# Altium schematic sheet Sheet1.SchDoc
size A; SheetNumber: 1; SheetTotal: 1
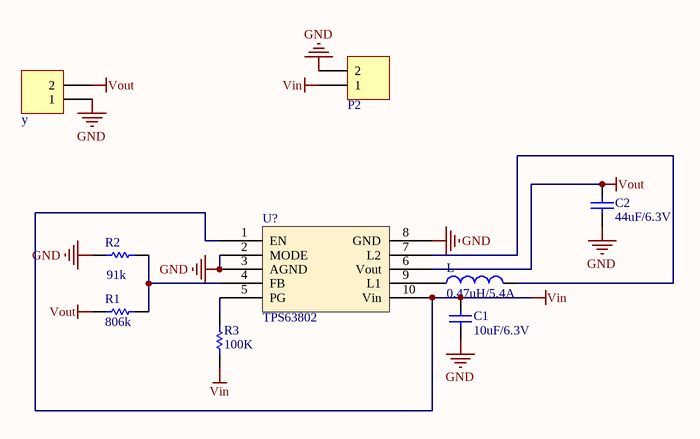
[diagram p0: Sheet1.SchDoc]

## Parts
C1  value 10uF/6.3V  [CAP-SM-0805]  (hidden comment: Cap Non-Pol SMD)
C2  value 44uF/6.3V  [CAP-SM-0805]  (hidden comment: Cap Non-Pol SMD)
L  value 0.47uH/5.4A  [INDUCTOR 12.5x12.5]  (hidden comment: Inductor)
P2  Domino 2  [DOMINO 2- 5mm]  (value not drawn)
R1  value 806k  [RES-SM-0603]  (hidden comment: RESISTOR SMD)
R2  value 91k  [RES-SM-0603]  (hidden comment: RESISTOR SMD)
R3  value 100K  [RES-SM-0603]  (hidden comment: RESISTOR SMD)
U?  TPS63802  [TPS63802]
y  Domino 2  [DOMINO 2- 5mm]  (value not drawn)

## Nets
GND: C1.2 C2.2 P2.2 R2.2 U?.2(MODE) U?.3(AGND) U?.8(GND) y.1
Vin: C1.1 P2.1 R3.1 U?.1(EN) U?.10(Vin)
Vout: C2.1 R1.1 U?.6(Vout) y.2
NetL_1: L.1 U?.9(L1)
NetL_2: L.2 U?.7(L2)
NetR1_2: R1.2 R2.1 U?.4(FB)
NetR3_2: R3.2 U?.5(PG)

## Library data of the parts
C1 C2 = Cap Non-Pol SMD: Capacitor
P2 y = Domino 2: Domino, 2-Pin; LatestRevisionDate: 17-Jul-2002; LatestRevisionNote: Re-released for DXP Platform.; Publisher: Altium Limited
R1-R3 = RESISTOR SMD: Resistor
U? = TPS63802: SMD